# EAGLE design Big Reds Dash2 (EAGLE 4.13)
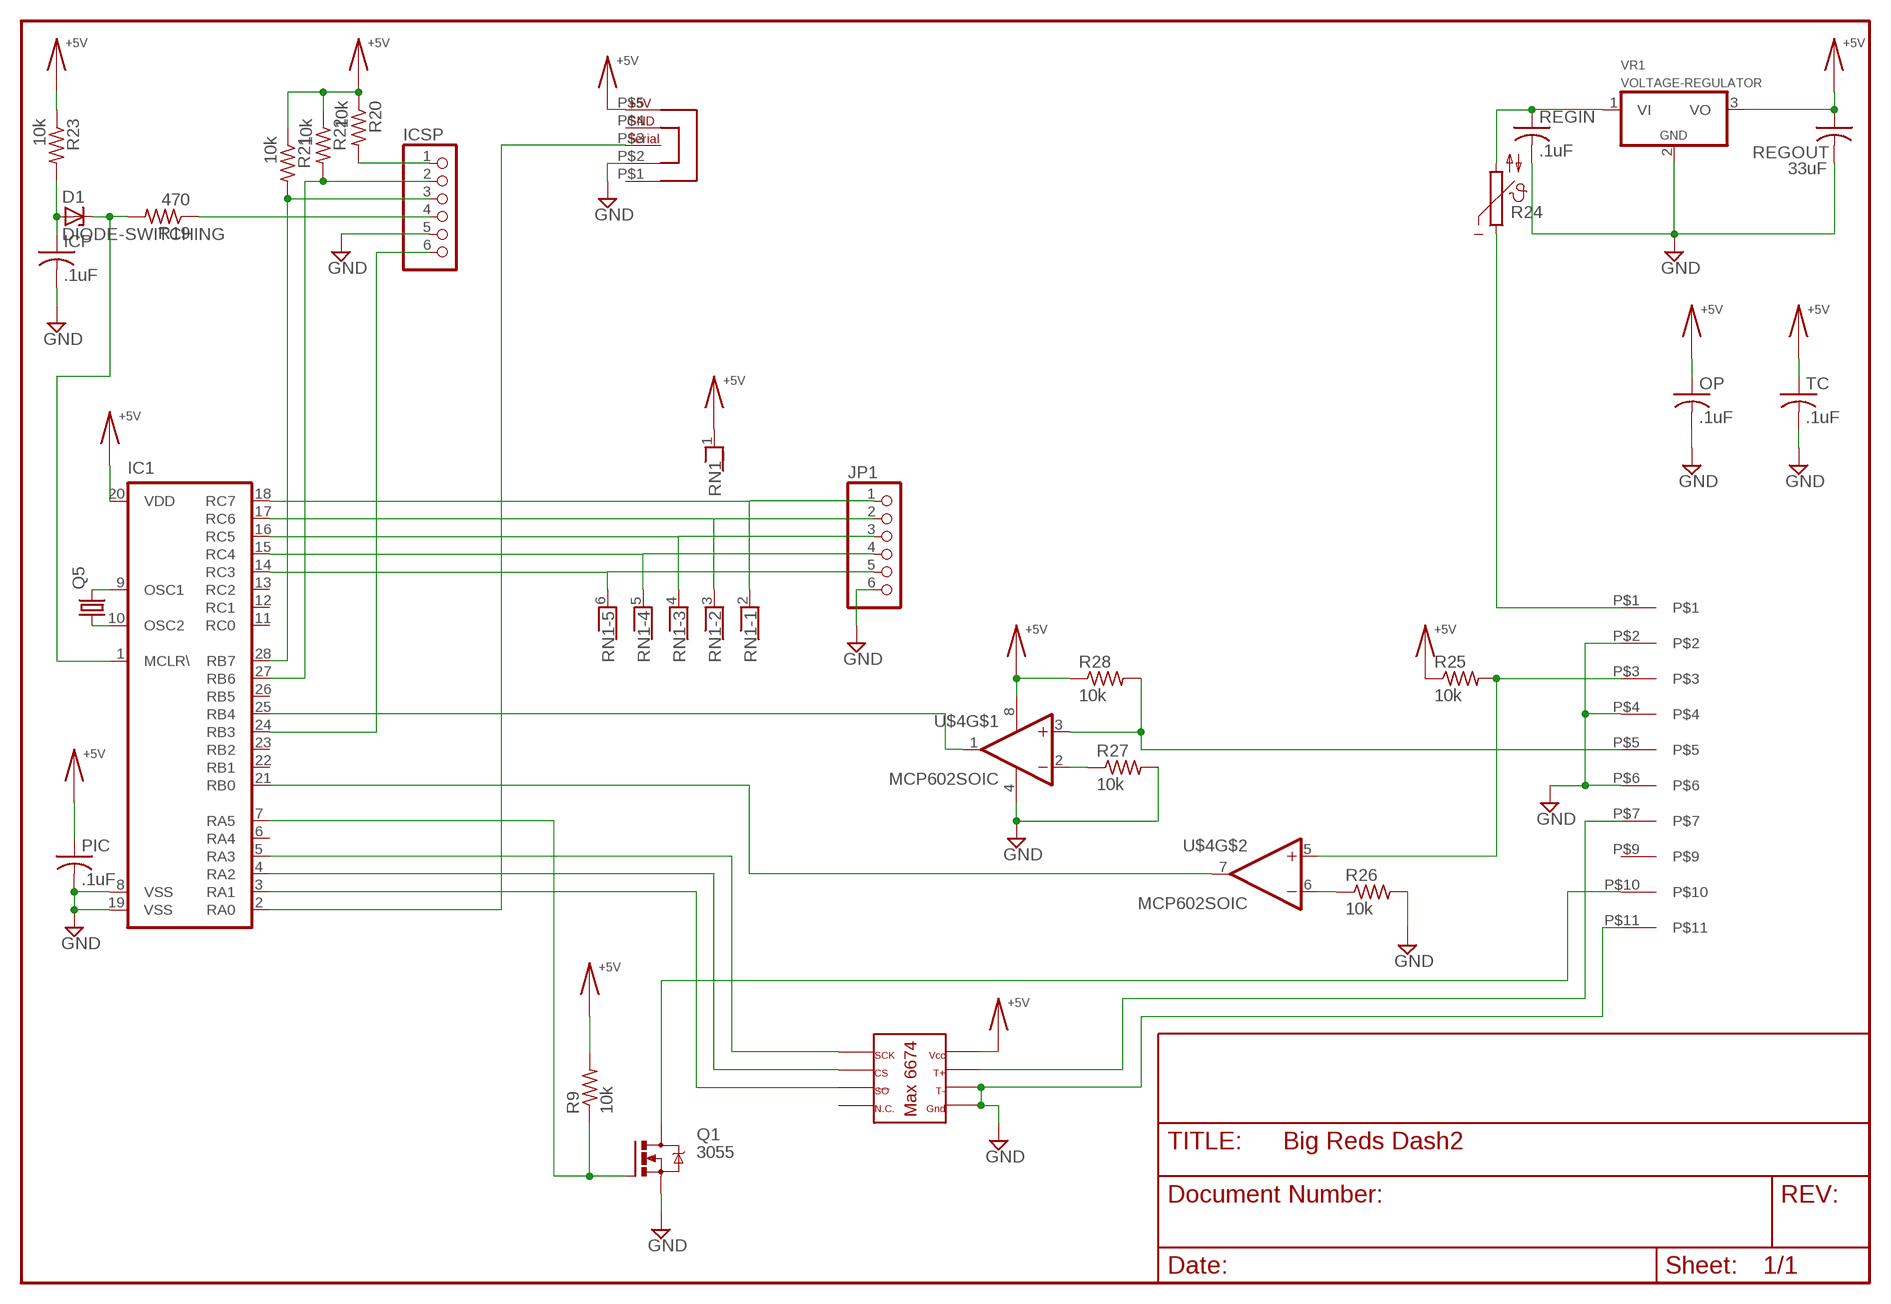
[diagram p0: schematic, sheet 1]

## Parts
D1  DIODE-SWITCHING  [SOT323-W]
IC1  PIC16F73SO  [SO-28W]
ICP  .1uF  CAPACITOR-NO-POLARITYC1210K  [C1210K]
ICSP  PINHD-1X6  [1X06]
JP1  PINHD-1X6  [1X06]
OP  .1uF  CAPACITOR-NO-POLARITYC1210K  [C1210K]
PIC  .1uF  CAPACITOR-NO-POLARITYC1210K  [C1210K]
Q1  3055  MTP3055VSOIC  [SOT223R_INFINEON]
Q5  CRYSTALSM49  [SM49]
R9  10k  RESISITORM1406  [M1406]
R19  470  RESISITORM1406  [M1406]
R20  10k  RESISITORM1406  [M1406]
R21  10k  RESISITORM1406  [M1406]
R22  10k  RESISITORM1406  [M1406]
R23  10k  RESISITORM1406  [M1406]
R24  NTC640-9  [N640]
R25  10k  RESISITORM1406  [M1406]
R26  10k  RESISITORM1406  [M1406]
R27  10k  RESISITORM1406  [M1406]
R28  10k  RESISITORM1406  [M1406]
REGIN  .1uF  CAPACITOR-NO-POLARITYC1210K  [C1210K]
REGOUT  33uF  CAPACITOR-NO-POLARITYC2220K  [C2220K]
RN1  RNX5  [RN-6]
TC  .1uF  CAPACITOR-NO-POLARITYC1210K  [C1210K]
U$1  ROUND1  [ROUND_BIG_RED]
U$2  MAX6674  [SO08]
U$3  SERIAL_DISPLAY  [SERIAL_DISPLAY]
U$4  MCP602SOIC  [SO08]
VR1  VOLTAGE-REGULATOR  [TO220S]

## Nets
+5V: IC1.20(VDD) OP.1 PIC.1 R9.2 R20.1 R21.1 R22.1 R23.1 R25.1 R28.1 REGOUT.1 RN1.1 TC.1 U$2.4 U$3.P$5 U$4.8(V+) VR1.3(VO)
GND: IC1.8(VSS) IC1.19(VSS) ICP.2 ICSP.5 JP1.6 OP.2 PIC.2 Q1.3(S) R26.2 R27.2 REGIN.2 REGOUT.2 TC.2 U$1.P$2 U$1.P$4 U$1.P$6 U$1.P$11 U$2.1 U$2.2 U$3.P$2 U$4.4(V-) VR1.2(GND)
N$1: IC1.18(RC7) JP1.1 RN1.2
N$2: IC1.28(RB7) ICSP.3 R21.2
N$3: IC1.21(RB0) U$4.7(OUT)
N$4: IC1.2(RA0) U$3.P$3
N$5: IC1.17(RC6) JP1.2 RN1.3
N$6: IC1.16(RC5) JP1.3 RN1.4
N$12: IC1.15(RC4) JP1.4 RN1.5
N$19: IC1.4(RA2) U$2.6
N$20: Q1.2(D) U$1.P$10
N$21: IC1.14(RC3) JP1.5 RN1.6
N$23: D1.3(C) IC1.1(MCLR\) R19.2
N$24: R27.1 U$4.2(-IN)
N$25: IC1.7(RA5) Q1.1(G) R9.1
N$27: R24.1 U$1.P$1
N$29: IC1.27(RB6) ICSP.2 R22.2
N$32: IC1.25(RB4) U$4.1(OUT)
N$38: IC1.9(OSC1) Q5.2
N$39: IC1.10(OSC2) Q5.1
N$41: R25.2 U$1.P$3 U$4.5(+IN)
N$43: IC1.5(RA3) U$2.5
N$46: R28.2 U$1.P$5 U$4.3(+IN)
N$48: U$1.P$7 U$2.3
N$52: IC1.3(RA1) U$2.7
N$59: IC1.24(RB3) ICSP.6
N$60: ICSP.1 R20.2
N$61: ICSP.4 R19.1
N$62: D1.1(A) ICP.1 R23.2
N$64: R24.2 REGIN.1 VR1.1(VI)
N$65: R26.1 U$4.6(-IN)
Unconnected: IC1.6(RA4) IC1.11(RC0) IC1.12(RC1) IC1.13(RC2) IC1.22(RB1) IC1.23(RB2) IC1.26(RB5) U$1.P$9 U$2.8 U$3.P$1 U$3.P$4

## Library data of the parts
D1 = 1 Dan's Common Parts:DIODE-SWITCHING: Z DIODE
IC1 = 1 Dan's Common Parts:PIC16F73: MICROCONTROLLER EPROM/ROM-based
ICP OP PIC REGIN REGOUT TC = 1 Dan's Common Parts:CAPACITOR-NO-POLARITY: CAPACITOR, American symbol
ICSP JP1 = pinhead:PINHD-1X6: PIN HEADER
Q1 = 1 Dan's Common Parts:MTP3055V: N-CHANNEL MOS FET
Q5 = 1 Dan's Common Parts:CRYSTAL: CRYSTAL
R9 R19-R23 R25-R28 = 1 Dan's Common Parts:RESISITOR: RESISTOR, American symbol
R24 = ptc-ntc:NTC640-9: PHILIPS NTC
RN1 = resistor-net:RNX5: RESISTOR NETWORK
U$1 = 1 Dan's Common Parts:ROUND1
U$2 = 1 Dan's Common Parts:MAX6674
U$3 = 1 Dan's Common Parts:SERIAL_DISPLAY
U$4 = 1 Dan's Common Parts:MCP602
VR1 = 1 Dan's Common Parts:VOLTAGE-REGULATOR: Positive VOLTAGE REGULATOR Source: http://cache.national.com/ds/LM/LM78L05.pdf http://www.fairchildsemi.com/ds/LM/LM7805.pdf

## Board
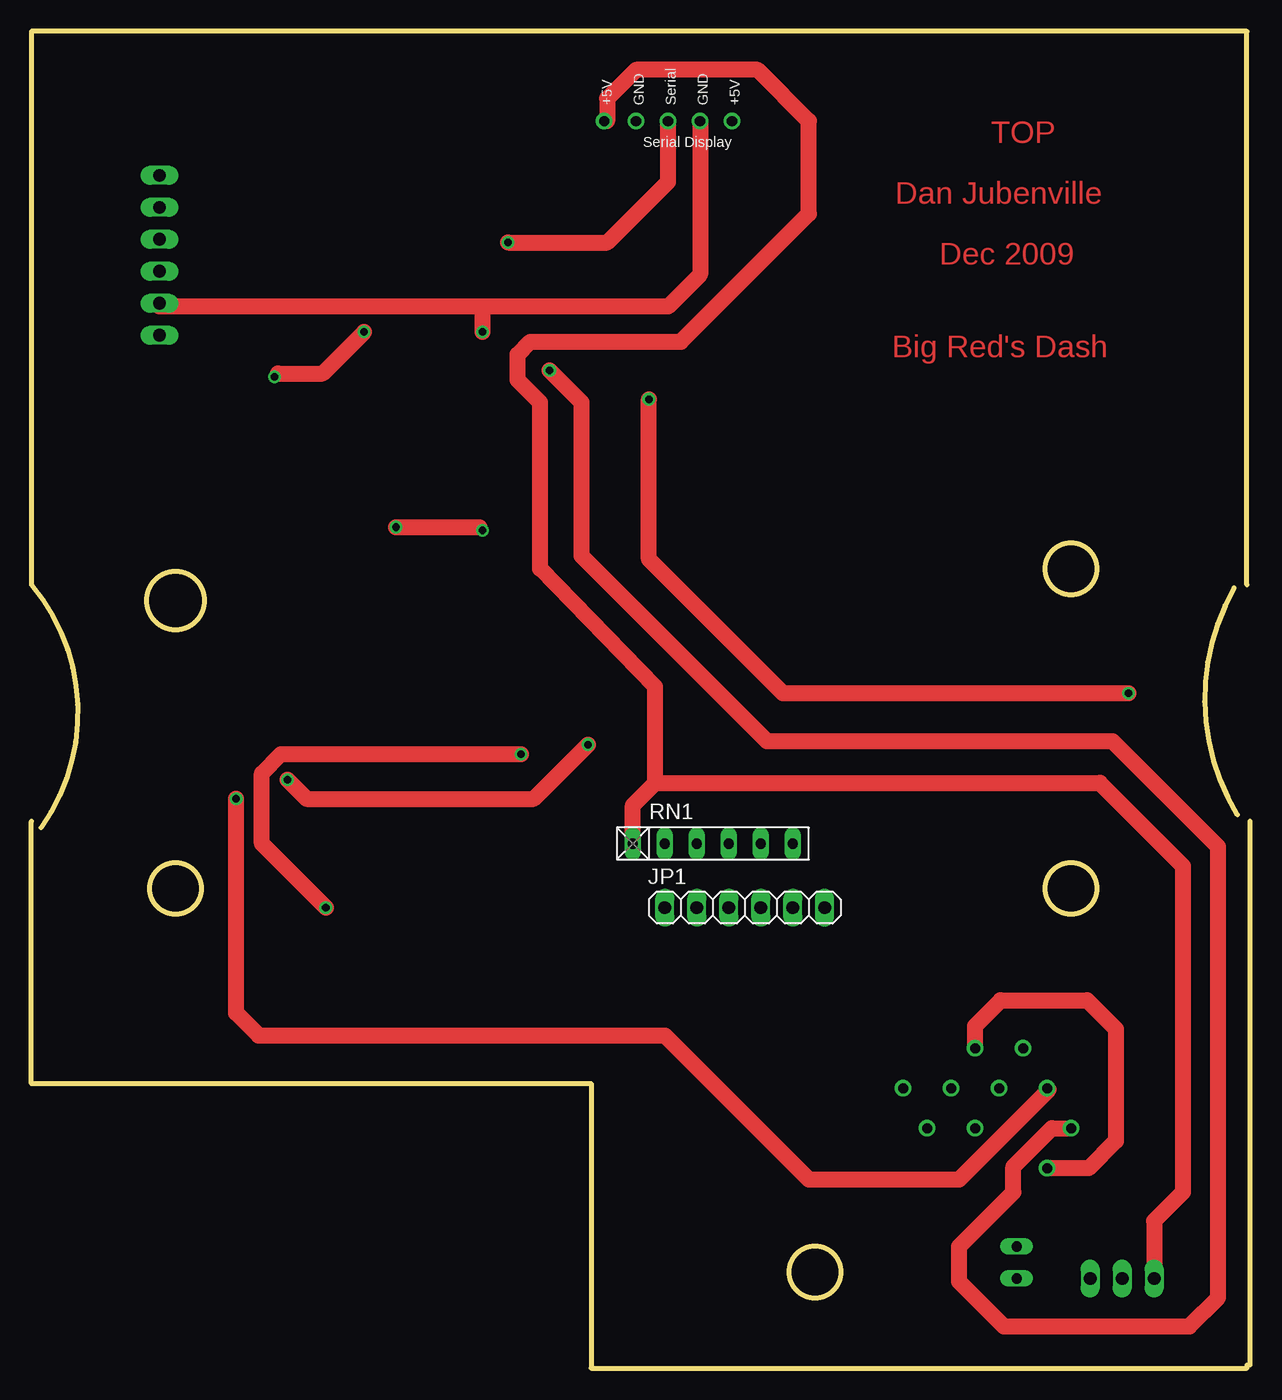
[diagram p1: board, top side]
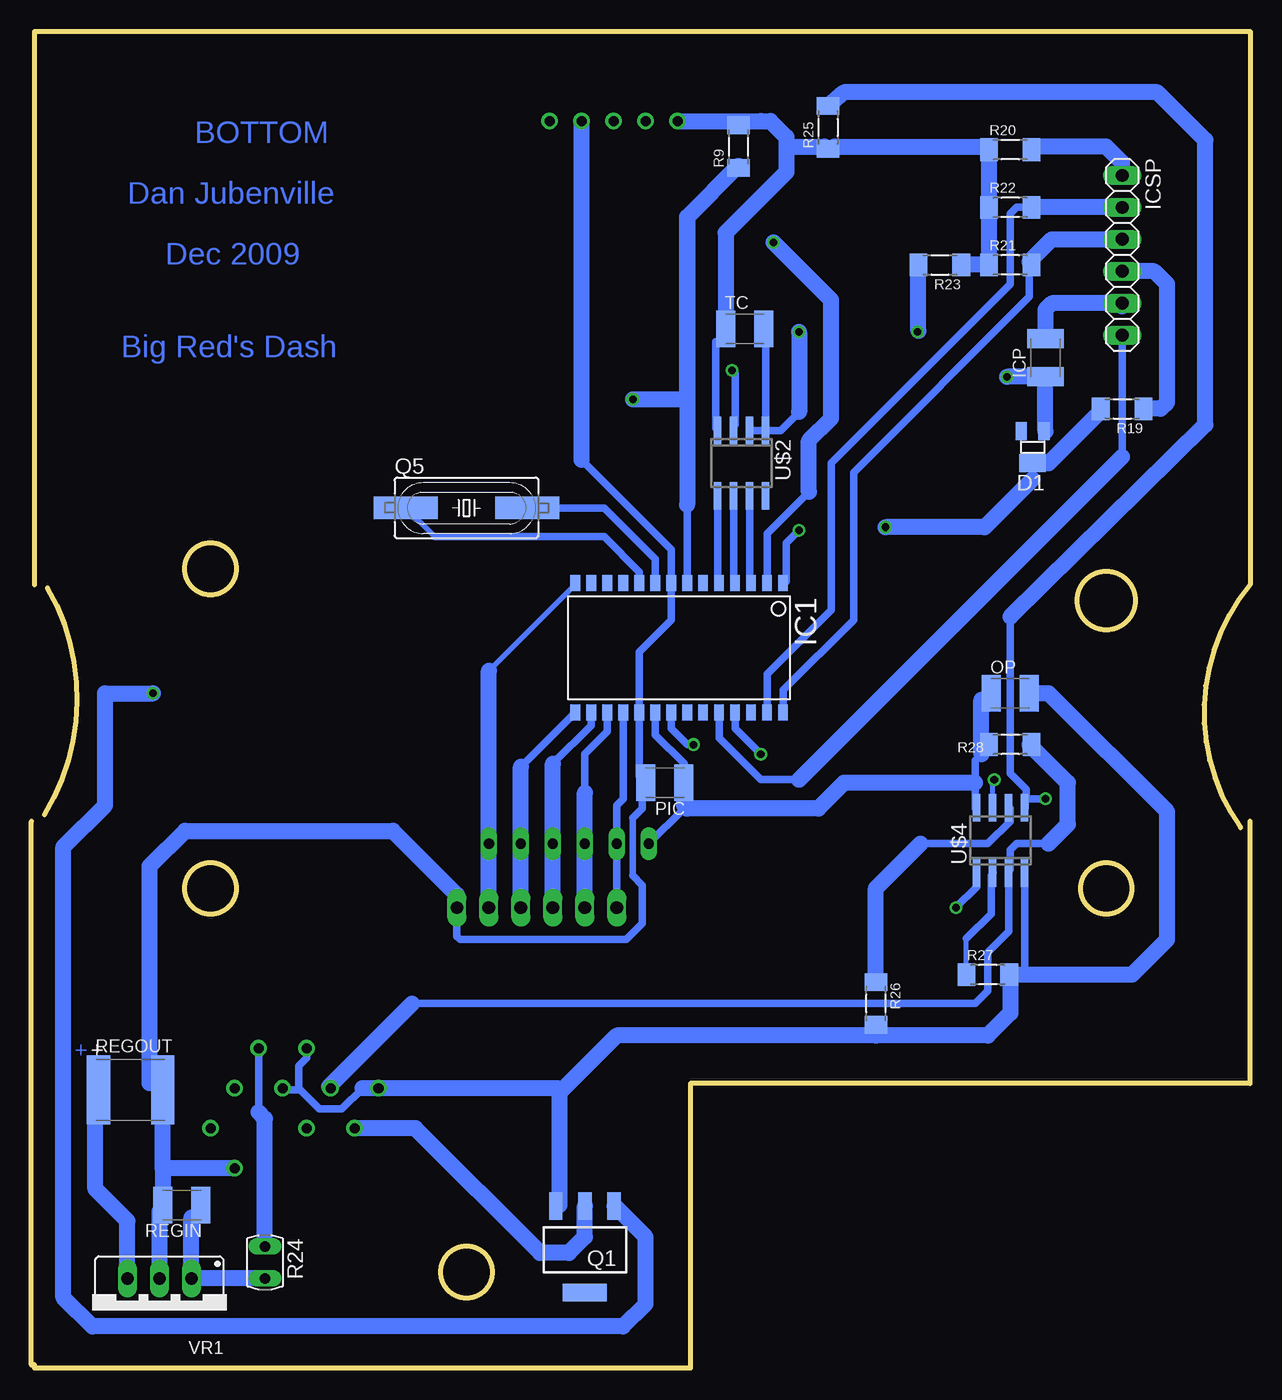
[diagram p2: board, bottom side, seen from below]

Size 96.77 x 106.17 mm. Coordinates in mm from the lower left corner, seen from the top.
Outline: 96.52,0 44.45,0 44.45,22.61 0,22.61 0,43.43
Outline: 0.76,42.93 arc75 0,62.23 0,106.17 96.52,106.17 96.52,62.23
Outline: 95.5,61.98 arc61 95.76,43.94
Outline: 96.52,0.25 96.77,0.25 96.77,43.43
Outline: circle at 62.23,7.62 radius 2.05
Outline: circle at 82.55,38.1 radius 2.03
Outline: circle at 82.55,63.5 radius 2.03
Outline: circle at 11.43,38.1 radius 2.03
Outline: circle at 11.43,60.96 radius 2.29
Copper layers (1*16): Top 0.035mm / dielectric 1.5mm / Bottom 0.035mm
Design rules "default": minimum track width 20mil, minimum drill 15mil, track to track 15mil, track to pad 15mil, pad to pad 15mil, via to via 15mil, smd to smd 0mil, copper to edge 40mil, drill to drill 8mil, minimum pad ring 10mil, minimum via ring 8mil, stop-mask expansion 4mil, vias tented up to drill 0mil, thermal gap 10mil

### Footprints (pad centres in the part's own frame; a part is rotated, then mirrored left to right if it is on the bottom)
SOT323-W = smd 0.9 x 1.45: 1 -0.9,-1.275; 2 0.9,-1.275 | smd 2.1 x 1.45: 3 0,1.275
SO-28W = smd 0.762 x 1.27: 1 -7.62,-5.207; 2 -6.35,-5.207; 3 -5.08,-5.207; 4 -3.81,-5.207; 5 -2.54,-5.207; 6 -1.27,-5.207; 7 0,-5.207; 8 1.27,-5.207; 9 2.54,-5.207; 10 3.81,-5.207; 11 5.08,-5.207; 12 6.35,-5.207; 13 7.62,-5.207; 14 8.89,-5.207; 15 8.89,5.08; 16 7.62,5.08; 17 6.35,5.08; 18 5.08,5.08; 19 3.81,5.08; 20 2.54,5.08; 21 1.27,5.08; 22 0,5.08; 23 -1.27,5.08; 24 -2.54,5.08; 25 -3.81,5.08; 26 -5.08,5.08; 27 -6.35,5.08; 28 -7.62,5.08
C1210K = smd 1.5 x 2.9: 1 -1.5,0; 2 1.5,0
1X06 = drill 1.016 long: 1 -6.35,0; 2 -3.81,0; 3 -1.27,0; 4 1.27,0; 5 3.81,0; 6 6.35,0
SOT223R_INFINEON = smd 1.067 x 2.184: 1 -2.311,-3.479; 2 0,-3.48; 3 2.312,-3.48 | smd 3.5 x 1.4: 4 0,3.404
SM49 = smd 5.08 x 1.778: 1 -4.826,0; 2 4.826,0
M1406 = smd 1.4 x 1.8: 1 -1.7,0; 2 1.7,0
N640 = drill 0.813 long: 1 -1.27,0; 2 1.27,0
C2220K = smd 1.85 x 5.5: 1 -2.55,0; 2 2.55,0
RN-6 = drill 0.813 long: 1 -6.35,0; 2 -3.81,0; 3 -1.27,0; 4 1.27,0; 5 3.81,0; 6 6.35,0
ROUND_BIG_RED = drill 0.8 round: P$1 12.7,19.05; P$2 16.51,19.05; P$3 10.795,15.875; P$4 14.605,15.875; P$5 18.415,15.875; P$6 22.225,15.875; P$7 8.89,12.7; P$9 16.51,12.7; P$10 20.32,12.7; P$11 10.795,9.525
SO08 = smd 0.6 x 2.2: 1 -1.905,-2.6; 2 -0.635,-2.6; 3 0.635,-2.6; 4 1.905,-2.6; 5 1.905,2.6; 6 0.635,2.6; 7 -0.635,2.6; 8 -1.905,2.6
SERIAL_DISPLAY = drill 0.8 round: P$1 1.27,1.27; P$2 1.27,3.81; P$3 1.27,6.35; P$4 1.27,8.89; P$5 1.27,11.43
TO220S = drill 1.016 long: 1 -2.54,-2.54; 2 0,-2.54; 3 2.54,-2.54

### Placement (x,y rotation side)
D1  17.27,73.15 180 bottom
IC1  44.7,57.15 180 bottom
ICP  16.26,80.26 90 bottom
ICSP  10.16,88.39 270 bottom
JP1  56.64,36.58 0 top
OP  19.05,53.59 0 bottom
PIC  46.48,46.48 180 bottom
Q1  52.83,9.4 180 bottom
Q5  62.23,68.33 0 bottom
R9  40.64,97.03 90 bottom
R19  10.16,76.2 180 bottom
R20  19.05,96.77 0 bottom
R21  19.05,87.63 0 bottom
R22  19.05,92.2 0 bottom
R23  24.64,87.63 180 bottom
R24  78.23,8.38 270 bottom
R25  33.53,98.55 90 bottom
R26  29.72,28.96 270 bottom
R27  20.83,31.24 0 bottom
R28  19.05,49.53 0 bottom
REGIN  84.84,12.95 180 bottom
REGOUT  88.9,22.1 0 bottom
RN1  54.1,41.66 0 top
TC  40.13,82.55 0 bottom
U$1  91.44,6.35 0 bottom
U$2  40.39,71.88 180 bottom
U$3  56.9,97.79 90 top
U$4  19.81,41.91 0 bottom
VR1  86.61,4.57 180 bottom

### Tracks (layer width: path | path; a pad name or v marks a point on that pad's centre or on a via)
+5V
  Top 0.406: VR1.3 89.15,6.86 | U$3.P$5 45.47,98.81 45.72,99.06
  Top 1.27: RN1.1 47.75,44.7 49.53,46.48 | 49.53,46.48 84.84,46.48 91.44,39.88 91.44,13.97 89.15,11.68 VR1.3 | 49.53,46.48 49.53,54.1 40.39,63.5 40.39,76.71 38.61,78.49 38.61,80.52 39.62,81.53 51.56,81.53 61.72,91.69 61.72,99.06 57.66,103.12 48.01,103.12 45.72,100.84 45.72,99.06
  Bottom 0.406: 44.98,44.43 PIC.1 44.96,46.48 44.96,48.01 | U$3.P$5 41.15,99.06 40.64,98.55 R9.2 40.64,99.06 38.86,99.06 | 33.78,97.03 33.53,96.77 | 20.83,97.03 20.75,96.95 R20.1 | R22.1 20.83,92.2 20.75,92.28 | R21.1 21.08,87.63 20.75,87.96 | 21.84,44.45 21.78,44.51 U$4.8 | 44.7,44.45 44.96,44.7 | OP.1 20.8,53.87 21.34,53.09 | 21.34,48.77 R28.1 21.16,49.2 21.34,48.77 | 21.84,48.26 21.34,48.77 | TC.1 41.63,82.32 42.42,81.53 | 42.42,74.68 42.29,74.55 U$2.4 | 91.69,22.1 REGOUT.1 | 33.53,96.77 R25.1 33.45,96.85 | 33.53,96.77 33.61,96.7 | 33.53,96.77 33.45,96.85 | 33.45,96.85 33.02,97.03
  Bottom 0.61: 44.98,44.43 RN1.1 | IC1.20 47.24,50.29 44.96,48.01 | 21.84,44.45 21.84,46.48 21.84,48.26 | 42.42,81.53 42.42,74.68
  Bottom 1.27: 36.83,97.03 33.78,97.03 | R20.1 20.75,92.28 | R22.1 20.75,87.96 | 21.84,46.48 32.26,46.48 34.29,44.45 44.7,44.45 | 44.96,44.7 44.96,46.48 | 21.34,48.77 21.34,53.09 | 41.63,90.19 TC.1 | 36.83,97.03 36.83,95 41.63,90.19 | 41.66,90.17 41.63,90.19 | 36.83,97.03 36.83,97.79 38.1,99.06 38.86,99.06 U$3.P$5 | VR1.3 89.15,11.68 91.69,14.22 91.69,22.1 | 33.02,97.03 20.83,97.03 | 21.08,87.63 R23.1
GND  (via drill 0.6)
  Top 0.406: U$1.P$2 74.93,25.15
  Top 1.27: U$3.P$2 53.09,86.87 50.55,84.33 35.81,84.33 | 35.81,84.33 10.16,84.33 ICSP.5 | U$1.P$11 83.95,15.88 86.11,18.03 86.11,26.92 83.82,29.21 76.96,29.21 74.93,27.18 U$1.P$2 | 35.81,84.33 v35.81,82.3
  Bottom 0.406: 48.01,46.48 48.51,46.99 | 48.01,46.48 PIC.2 | 48.26,46.23 48.01,46.48 | 53.09,95 53.09,94.74 | 62.99,37.59 JP1.6 | 87.39,22.62 86.36,21.59 REGOUT.2 | 19.05,31.5 R27.2 18.8,31.24 17.91,31.37 | 29.72,26.42 R26.2 | 54.86,21.84 54.74,21.97 54.99,22.22 | 54.86,12.95 54.94,12.88 Q1.3 | 38.48,81.66 38.61,81.79 38.61,82.8 38.63,82.78 TC.2 | 86.61,12.45 86.34,12.72 REGIN.2 86.36,12.95 REGIN.2 | 86.35,15.75 86.36,15.75 86.23,15.88 | 76.71,22.1 U$1.P$4 75.56,22.22 | 38.41,74.48 U$2.1 | U$2.2 38.41,74.48 | 38.41,74.48 38.35,74.42 | 16.26,81.53 ICP.2 16.26,84.58 ICSP.5
  Bottom 0.508: 49.02,39.12 49.02,43.69
  Bottom 0.61: 48.51,46.99 IC1.19 48.51,56.9 45.97,59.44 IC1.8 45.97,65.02 53.09,72.14 | JP1.6 62.99,34.29 62.74,34.04 49.53,34.04 48.26,35.31 48.26,38.35 49.02,39.12 | 49.02,43.69 48.26,44.45 48.26,46.23 | 17.91,31.37 U$4.4 | U$2.1 38.48,81.66 | 70.48,22.22 72.14,20.57 73.91,20.57 75.44,22.1 76.71,22.1 | U$1.P$2 74.93,24.64 75.56,24 75.56,22.22 | U$2.2 37.28,74.48 35.81,75.95
  Bottom 1.27: 53.09,72.14 53.09,95 U$3.P$2 | 62.99,37.59 68.07,42.67 84.58,42.67 87.39,39.87 87.39,22.62 | ICP.2 16.26,84.07 15.75,84.58 ICSP.5 | OP.2 16,53.59 6.6,44.2 6.6,34.04 9.4,31.24 18.8,31.24 | 19.05,31.5 19.05,28.19 20.83,26.42 29.72,26.42 50.29,26.42 54.74,21.97 | 54.86,21.84 54.86,12.95 | 86.61,12.45 VR1.2 | REGOUT.2 86.35,15.75 REGIN.2 | U$1.P$11 86.23,15.88 | 70.48,22.22 U$1.P$6 54.99,22.22 | v35.81,82.3 35.81,75.95 | ICSP.5 9.91,84.58 | ICSP.5 10.16,84.33
N$1
  Bottom 0.61: IC1.18 49.78,45.21 50.29,44.7 RN1.2 JP1.1
N$2
  Bottom 0.406: 17.78,87.63 R21.2 17.6,87.81 17.53,87.88 17.78,87.63
  Bottom 0.61: IC1.28 37.08,53.85 31.5,59.44 31.5,71.12 17.53,85.09 17.53,87.88
  Bottom 1.27: 17.53,87.88 15.75,89.66 ICSP.3
N$3  (via drill 0.6)
  Top 1.27: v20.32,46.74 21.84,45.21 39.88,45.21 v44.2,49.53
  Bottom 0.406: U$4.7 20.45,46.36 v20.32,46.74 | v44.2,49.53 44.7,49.53
  Bottom 0.61: 44.7,49.53 45.97,50.8 IC1.21
N$4  (via drill 0.6)
  Top 0.406: U$3.P$3 50.29,99.31
  Top 1.27: v37.85,89.41 45.72,89.41 50.55,94.23 U$3.P$3
  Bottom 0.406: IC1.2 38.35,62.23
  Bottom 0.61: IC1.2 38.35,66.29 35.05,69.6
  Bottom 1.27: 35.05,69.6 35.05,73.66 33.27,75.44 33.27,84.84 v37.85,89.41
N$5
  Bottom 0.406: JP1.2 52.83,36.32
  Bottom 0.61: IC1.17 51.05,50.55 52.83,48.77 52.83,45.72
  Bottom 1.27: 52.83,45.72 RN1.3 JP1.2
N$6
  Bottom 0.61: IC1.16 52.32,51.05 55.37,48.01
  Bottom 1.27: 55.37,48.01 RN1.4 JP1.3
N$12
  Bottom 0.406: JP1.4 57.91,36.32
  Bottom 0.61: 57.91,47.75 IC1.15
  Bottom 1.27: 57.91,47.75 RN1.5 JP1.4
N$19
  Bottom 0.406: IC1.4 40.89,62.74 41.02,62.87
  Bottom 0.61: 41.02,62.87 U$2.6
N$20
  Bottom 1.27: Q1.2 52.83,10.41 54.1,9.14 56.39,9.14 66.29,19.05 U$1.P$10
N$21
  Bottom 0.406: IC1.14 53.59,62.23 60.45,55.37
  Bottom 1.27: JP1.5 RN1.6 60.45,55.37
N$23  (via drill 0.6)
  Top 0.406: 35.56,66.8 v35.81,66.55
  Top 1.27: v28.96,66.8 35.56,66.8
  Bottom 0.406: 11.86,76.02 R19.2 | 16,71.88 D1.3 17.27,70.61 | 36.83,62.48 36.96,62.36 IC1.1
  Bottom 0.61: v35.81,66.55 36.83,65.53 36.83,62.48
  Bottom 1.27: 16,71.88 11.86,76.02 | 17.27,70.61 21.08,66.8 v28.96,66.8
N$24
  Bottom 0.406: R27.1 22.53,34.11 | 20.38,39.31 20.32,39.37 | 20.38,39.31 U$4.2 | 20.57,39.12 20.38,39.31
  Bottom 0.61: 22.53,34.11 20.57,36.07 20.57,39.12
N$25  (via drill 0.6)
  Top 1.27: v49.02,76.96 49.02,64.26 59.69,53.59 v87.12,53.59
  Bottom 0.406: 40.64,95.5 R9.1 | 50.47,12.88 Q1.1
  Bottom 0.61: 44.7,68.58 IC1.7
  Bottom 1.27: 44.7,91.44 44.7,68.58 | 44.7,91.44 40.64,95.5 | 50.47,12.88 48.01,10.41 48.01,5.08 49.78,3.3 91.95,3.3 94.23,5.59 94.23,41.4 90.93,44.7 90.93,53.59 v87.12,53.59 | v49.02,76.96 44.7,76.96 44.7,91.44
N$27
  Bottom 0.61: 78.74,20.32 U$1.P$1
  Bottom 1.27: R24.1 78.23,19.81 78.74,20.32
N$29
  Bottom 0.406: IC1.27 38.35,52.32
  Bottom 0.61: R22.2 18.54,92.2 19.05,91.69 19.05,86.11 33.27,71.88 33.27,60.2 38.35,55.12 38.35,52.32
  Bottom 1.27: ICSP.2 R22.2
N$32  (via drill 0.6)
  Top 1.27: v23.37,36.58 18.29,41.66 18.29,47.24 19.81,48.77 v38.86,48.77
  Bottom 0.406: U$4.1 21.72,38.23 | IC1.25 40.89,52.32
  Bottom 0.61: 21.72,38.23 v23.37,36.58 | v38.86,48.77 40.89,50.8 IC1.25
N$38
  Bottom 0.406: Q5.2 57.91,68.33
  Bottom 0.61: IC1.9 47.24,64.26 51.31,68.33 Q5.2
N$39
  Bottom 0.406: 64.77,66.04 Q5.1
  Bottom 0.61: IC1.10 48.51,63.25 51.31,66.04 64.77,66.04
N$41  (via drill 0.6)
  Top 0.406: 80.52,22.35 U$1.P$3 80.77,22.1
  Top 1.27: v16.26,45.21 16.26,28.19 18.03,26.42 50.29,26.42 61.72,14.99 73.66,14.99 80.77,22.1
  Bottom 0.406: U$4.5 17.84,44.51 17.78,44.45 17.78,45.21
  Bottom 0.61: 19.05,59.69 19.05,47.24 17.78,45.97 17.78,45.21 v16.26,45.21
  Bottom 1.27: R25.2 32.26,101.35 7.37,101.35 3.56,97.54 3.56,74.93 19.05,59.69
N$43
  Bottom 0.406: IC1.5 42.16,62.48 42.29,62.61
  Bottom 0.61: 42.29,62.61 U$2.5
N$46
  Bottom 0.406: 17.53,49.53 R28.2 | 19.05,39.62 19.18,39.5 U$4.3 | 73.15,22.35 U$1.P$5
  Bottom 0.61: 16,41.66 18.54,41.66 19.05,41.15 19.05,39.62 | U$4.3 19.18,34.67 20.83,33.02 20.83,29.97 21.84,28.96 66.55,28.96
  Bottom 1.27: 17.53,49.53 14.48,46.48 14.48,43.18 16,41.66 | 66.55,28.96 73.15,22.35
N$48  (via drill 0.6)
  Top 0.406: 81.03,19.05 78.23,16.26
  Top 1.27: U$1.P$7 81.03,19.05 77.98,16 77.98,13.97 73.66,9.65 73.66,6.86 77.22,3.3 91.95,3.3 94.23,5.59 94.23,41.4 85.85,49.78 58.42,49.78 43.69,64.52 43.69,76.71 v41.15,79.25
  Bottom 0.406: v41.15,79.25 40.89,78.99 | 40.89,74.93 41.02,74.8 U$2.3
  Bottom 0.61: 40.89,78.99 40.89,74.93
N$52
  Bottom 0.406: IC1.3 39.62,62.48 39.75,62.61
  Bottom 0.61: 39.75,62.61 U$2.7
N$59
  Bottom 0.61: 10.16,72.39 ICSP.6 | 35.81,46.74 38.86,46.74 42.16,50.04 IC1.24
  Bottom 1.27: 35.81,46.74 10.16,72.39
N$60
  Bottom 1.27: ICSP.1 10.16,95.76 11.43,97.03 17.27,97.03 17.35,96.95 R20.2
N$61
  Bottom 1.27: ICSP.4 7.62,87.12 6.6,86.11 6.6,76.71 7.11,76.2 R19.1
N$62  (via drill 0.6)
  Top 0.406: v19.3,78.74 19.56,78.99
  Top 1.27: v26.42,82.3 23.11,78.99 19.56,78.99
  Bottom 0.406: 16.26,74.42 16.26,74.43 D1.1 | v26.42,82.3 26.34,82.37 | 16.26,78.74 ICP.1
  Bottom 1.27: 16.26,74.42 16.26,78.74 v19.3,78.74 | 26.34,82.37 R23.2
N$64
  Bottom 0.406: REGIN.1 83.34,12.72 83.31,12.7 84.07,11.94
  Bottom 1.27: R24.2 VR1.1 84.07,11.94
N$65
  Bottom 0.406: 19.05,44.45 19.11,44.51 U$4.6
  Bottom 0.61: 26.16,41.66 20.83,41.66 19.05,43.43 19.05,44.45
  Bottom 1.27: R26.1 29.72,38.1 26.16,41.66

### Text on the board
Top: TOP | Dan Jubenville | Dec 2009 | Big Red's Dash
Bottom: BOTTOM | Dan Jubenville | Dec 2009 | Big Red's Dash